# EAGLE design nedonand6 (EAGLE 5.12)
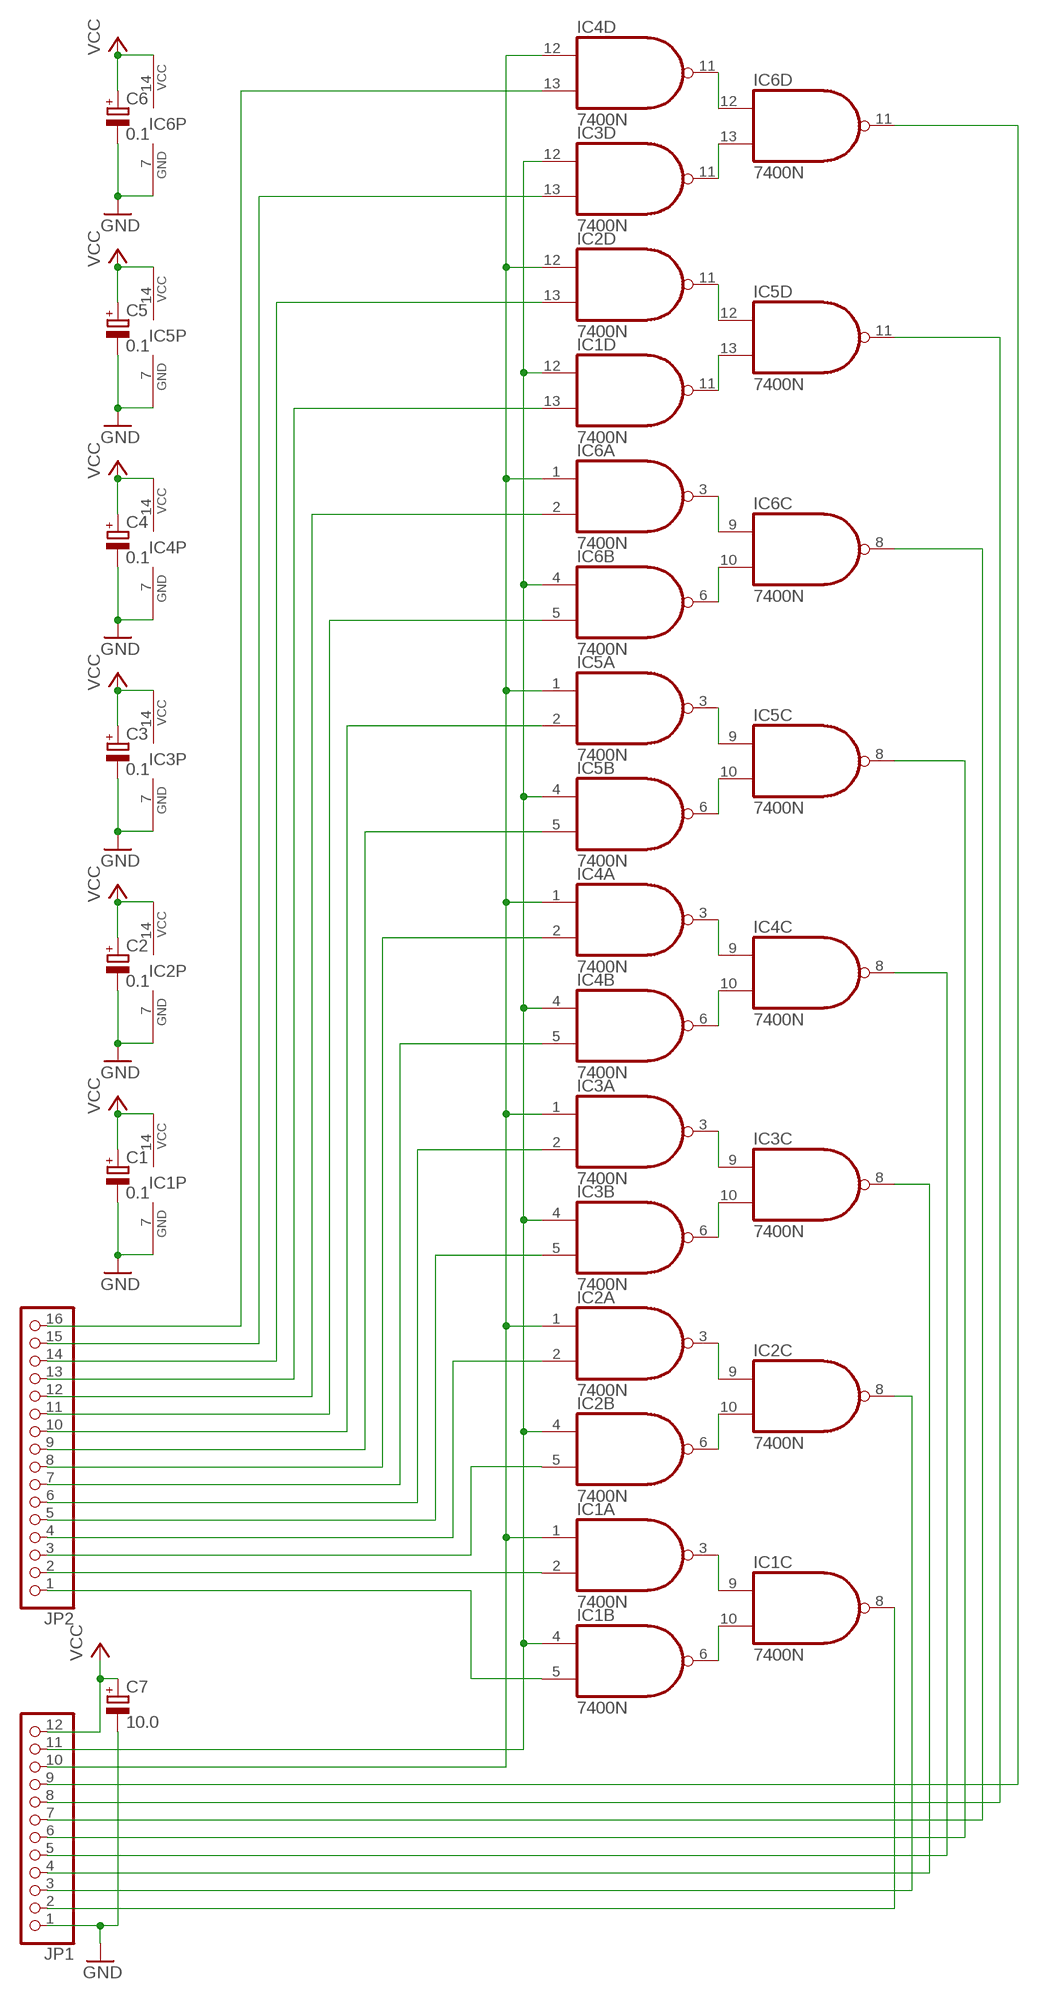
[diagram p0: schematic, sheet 1]

## Parts
C1  0.1  CPOL-EUB45181A  [B45181A]
C2  0.1  CPOL-EUB45181A  [B45181A]
C3  0.1  CPOL-EUB45181A  [B45181A]
C4  0.1  CPOL-EUB45181A  [B45181A]
C5  0.1  CPOL-EUB45181A  [B45181A]
C6  0.1  CPOL-EUB45181A  [B45181A]
C7  10.0  CPOL-EUE2,5-6E  [E2,5-6E]
IC1  7400N  [DIL14]
IC2  7400N  [DIL14]
IC3  7400N  [DIL14]
IC4  7400N  [DIL14]
IC5  7400N  [DIL14]
IC6  7400N  [DIL14]
JP1  PINHD-1X12/90  [1X12/90]
JP2  PINHD-1X16/90  [1X16/90]

## Nets
GND: C1.- C2.- C3.- C4.- C5.- C6.- C7.- IC1.7(P:GND) IC2.7(P:GND) IC3.7(P:GND) IC4.7(P:GND) IC5.7(P:GND) IC6.7(P:GND) JP1.1
N$1: IC4.11(D:O) IC6.12(D:I0)
N$2: IC1.3(A:O) IC1.9(C:I0)
N$3: IC1.6(B:O) IC1.10(C:I1)
N$4: IC1.4(B:I0) IC1.12(D:I0) IC2.4(B:I0) IC3.4(B:I0) IC3.12(D:I0) IC4.4(B:I0) IC5.4(B:I0) IC6.4(B:I0) JP1.11
N$5: IC1.1(A:I0) IC2.1(A:I0) IC2.12(D:I0) IC3.1(A:I0) IC4.1(A:I0) IC4.12(D:I0) IC5.1(A:I0) IC6.1(A:I0) JP1.10
N$6: IC2.3(A:O) IC2.9(C:I0)
N$7: IC1.2(A:I1) JP2.2
N$8: IC1.5(B:I1) JP2.1
N$9: IC2.6(B:O) IC2.10(C:I1)
N$10: IC2.5(B:I1) JP2.3
N$11: IC3.11(D:O) IC6.13(D:I1)
N$13: IC3.3(A:O) IC3.9(C:I0)
N$14: IC3.6(B:O) IC3.10(C:I1)
N$15: IC3.5(B:I1) JP2.5
N$16: IC2.11(D:O) IC5.12(D:I0)
N$18: IC4.3(A:O) IC4.9(C:I0)
N$19: IC4.6(B:O) IC4.10(C:I1)
N$20: IC4.5(B:I1) JP2.7
N$21: IC1.11(D:O) IC5.13(D:I1)
N$23: IC5.3(A:O) IC5.9(C:I0)
N$24: IC5.6(B:O) IC5.10(C:I1)
N$25: IC5.5(B:I1) JP2.9
N$28: IC6.3(A:O) IC6.9(C:I0)
N$29: IC6.6(B:O) IC6.10(C:I1)
N$30: IC6.5(B:I1) JP2.11
N$33: IC2.2(A:I1) JP2.4
N$35: IC3.2(A:I1) JP2.6
N$37: IC4.2(A:I1) JP2.8
N$39: IC5.2(A:I1) JP2.10
N$41: IC6.2(A:I1) JP2.12
N$42: IC1.13(D:I1) JP2.13
N$43: IC2.13(D:I1) JP2.14
N$44: IC3.13(D:I1) JP2.15
N$45: IC4.13(D:I1) JP2.16
N$46: IC1.8(C:O) JP1.2
N$47: IC2.8(C:O) JP1.3
N$48: IC3.8(C:O) JP1.4
N$49: IC4.8(C:O) JP1.5
N$50: IC5.8(C:O) JP1.6
N$51: IC6.8(C:O) JP1.7
N$52: IC5.11(D:O) JP1.8
N$53: IC6.11(D:O) JP1.9
VCC: C1.+ C2.+ C3.+ C4.+ C5.+ C6.+ C7.+ IC1.14(P:VCC) IC2.14(P:VCC) IC3.14(P:VCC) IC4.14(P:VCC) IC5.14(P:VCC) IC6.14(P:VCC) JP1.12

## Library data of the parts
C1-C7 = rcl:CPOL-EU: POLARIZED CAPACITOR, European symbol
IC1-IC6 = 74xx-us:74*00: Quad 2-input NAND gate
JP1 = pinhead:PINHD-1X12: PIN HEADER
JP2 = pinhead:PINHD-1X16: PIN HEADER

## Board
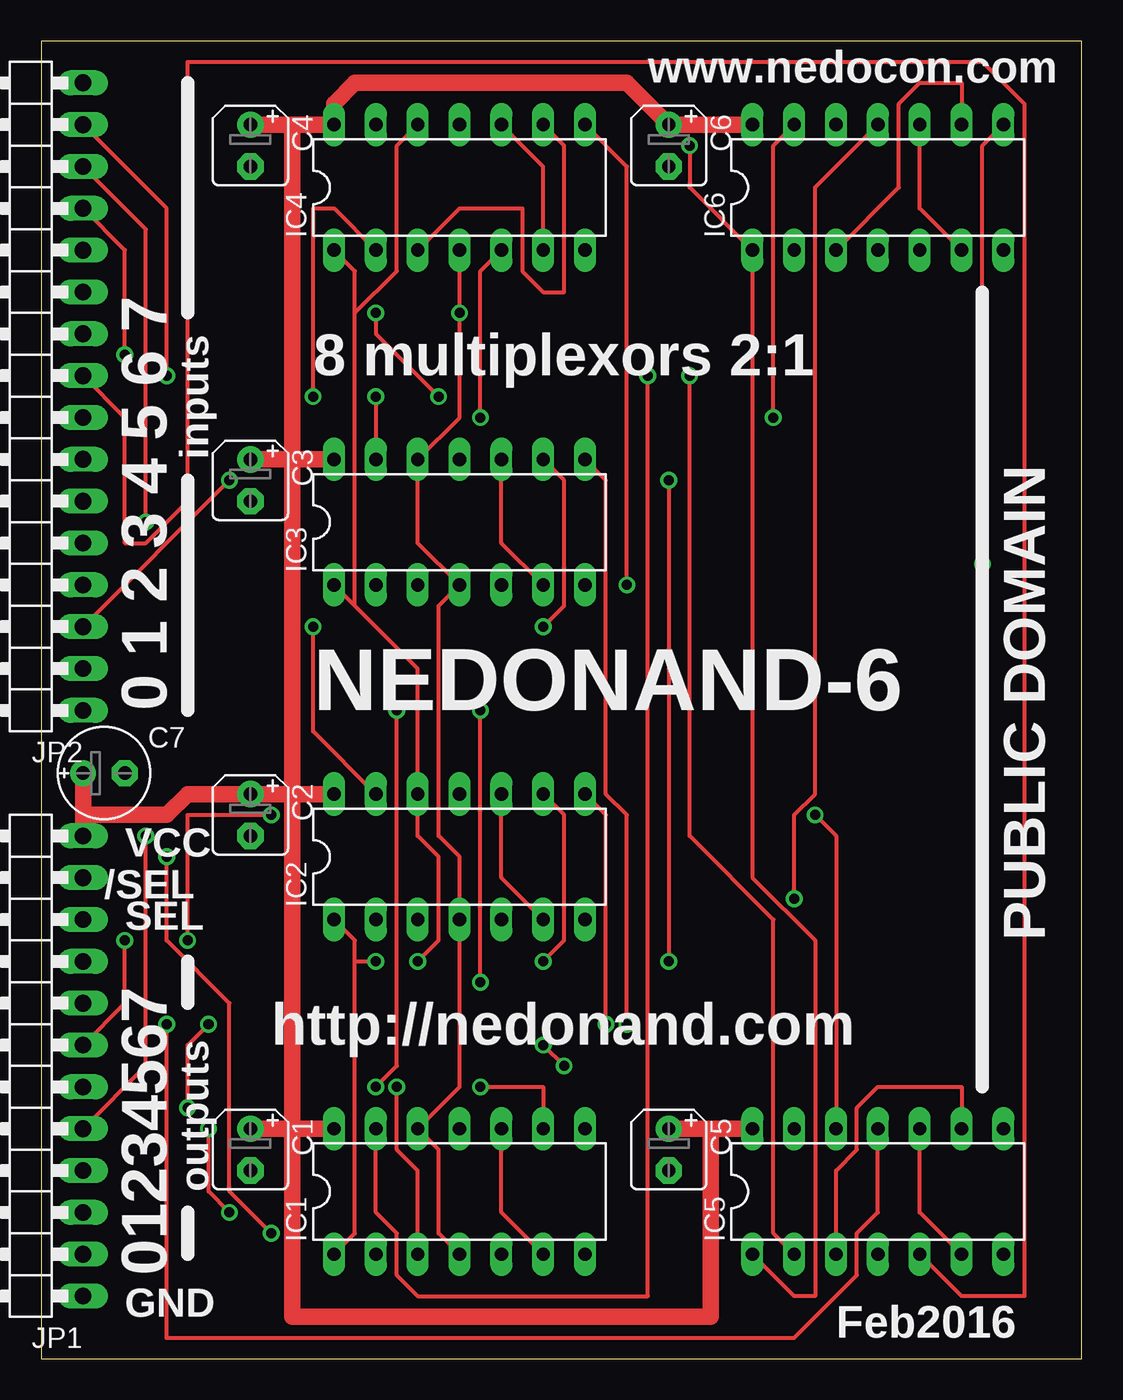
[diagram p1: board, top side]
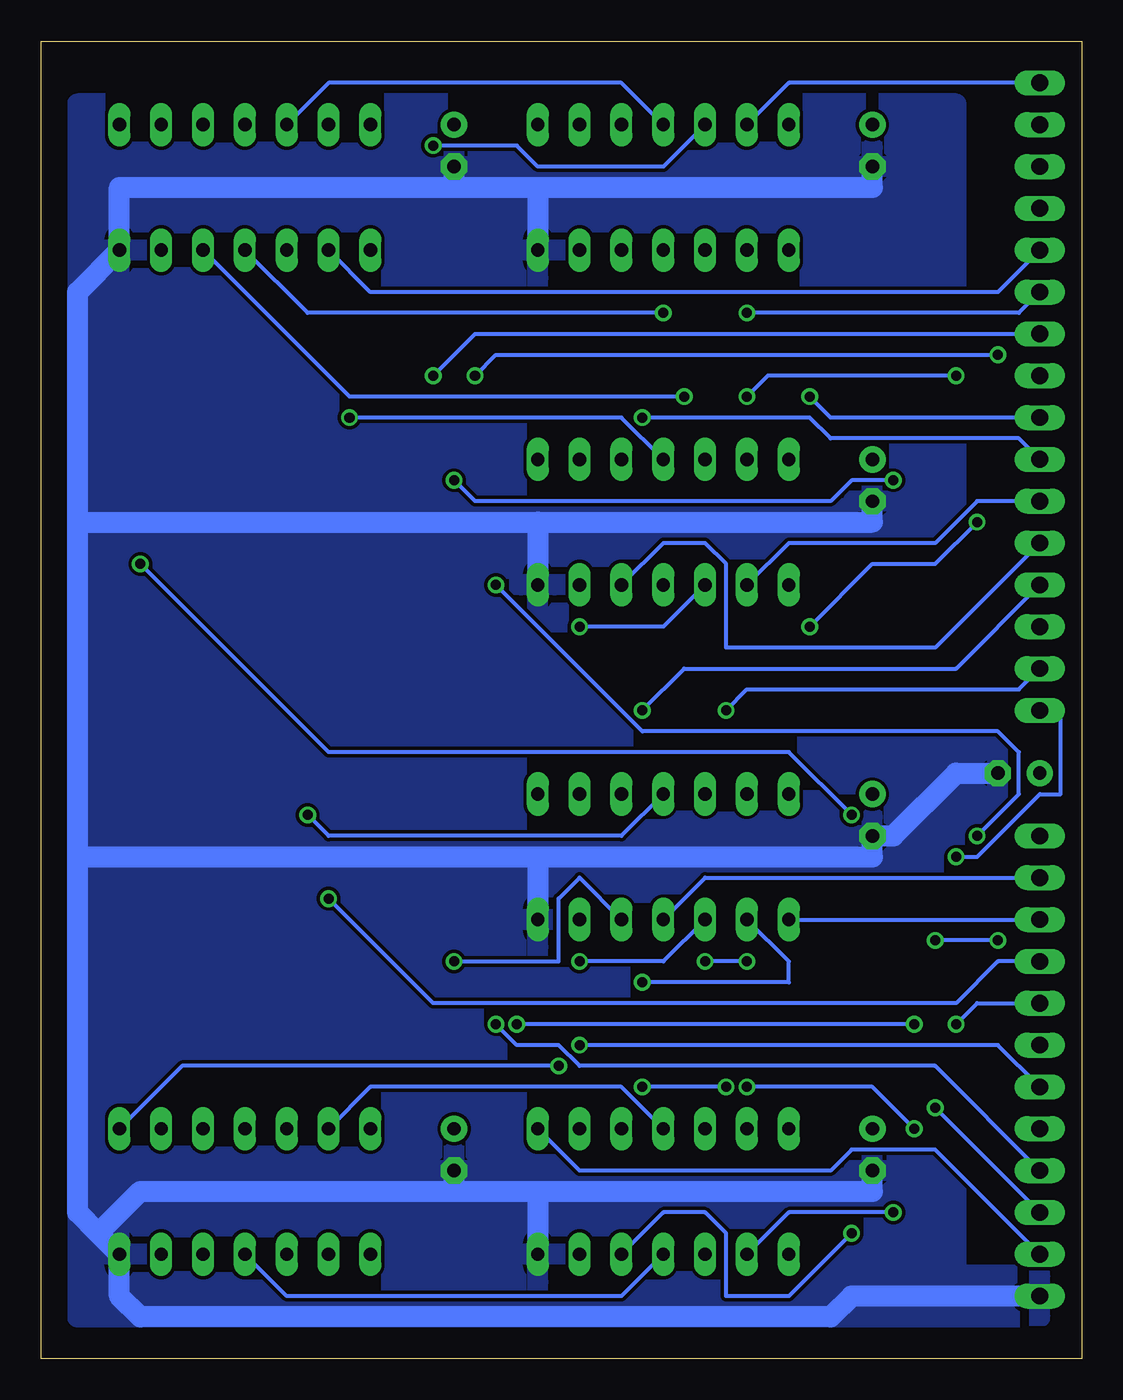
[diagram p2: board, bottom side, seen from below]

Size 63.17 x 80 mm. Coordinates in mm from the lower left corner, seen from the top.
Outline: 0,0 63.17,0 63.17,80 0,80 0,0
Copper layers (1*16): Top 0.035mm / dielectric 1.5mm / Bottom 0.035mm
Design rules "default": minimum track width 10mil, minimum drill 24mil, track to track 8mil, track to pad 8mil, pad to pad 8mil, via to via 8mil, smd to smd 8mil, copper to edge 40mil, drill to drill 8mil, minimum pad ring 10mil, minimum via ring 8mil, stop-mask expansion 4mil, vias tented up to drill 0mil, thermal gap 10mil

### Footprints (pad centres in the part's own frame; a part is rotated, then mirrored left to right if it is on the bottom)
B45181A = drill 0.813 pad 1.6 round: + -1.27,0 | drill 0.813 pad 1.6 octagon: - 1.27,0
E2,5-6E = drill 0.813 pad 1.575 round: + -1.27,0 | drill 0.813 pad 1.575 octagon: - 1.27,0
DIL14 = drill 0.813 long: 1 -7.62,-3.81; 2 -5.08,-3.81; 3 -2.54,-3.81; 4 0,-3.81; 5 2.54,-3.81; 6 5.08,-3.81; 7 7.62,-3.81; 8 7.62,3.81; 9 5.08,3.81; 10 2.54,3.81; 11 0,3.81; 12 -2.54,3.81; 13 -5.08,3.81; 14 -7.62,3.81
1X12/90 = drill 1.016 long: 1 -13.97,-3.81; 2 -11.43,-3.81; 3 -8.89,-3.81; 4 -6.35,-3.81; 5 -3.81,-3.81; 6 -1.27,-3.81; 7 1.27,-3.81; 8 3.81,-3.81; 9 6.35,-3.81; 10 8.89,-3.81; 11 11.43,-3.81; 12 13.97,-3.81
1X16/90 = drill 1.016 long: 1 -19.05,-3.81; 2 -16.51,-3.81; 3 -13.97,-3.81; 4 -11.43,-3.81; 5 -8.89,-3.81; 6 -6.35,-3.81; 7 -3.81,-3.81; 8 -1.27,-3.81; 9 1.27,-3.81; 10 3.81,-3.81; 11 6.35,-3.81; 12 8.89,-3.81; 13 11.43,-3.81; 14 13.97,-3.81; 15 16.51,-3.81; 16 19.05,-3.81

### Placement (x,y rotation side)
C1  12.7,12.7 270 top
C2  12.7,33.02 270 top
C3  12.7,53.34 270 top
C4  12.7,73.66 270 top
C5  38.1,12.7 270 top
C6  38.1,73.66 270 top
C7  3.81,35.56 0 top
IC1  25.4,10.16 0 top
IC2  25.4,30.48 0 top
IC3  25.4,50.8 0 top
IC4  25.4,71.12 0 top
IC5  50.8,10.16 0 top
IC6  50.8,71.12 0 top
JP1  -1.27,17.78 90 top
JP2  -1.27,58.42 90 top

### Tracks (layer width: path | path; a pad name or v marks a point on that pad's centre or on a via)
GND
  Bottom 1.27: JP1.1 13.97,3.81 15.24,2.54 57.15,2.54 58.42,3.81 IC5.7 59.69,7.62 | 60.96,30.48 60.96,8.89 59.69,7.62 | 60.96,30.48 60.96,50.8 | 60.96,50.8 60.96,64.77 IC6.7 58.42,71.12 38.1,71.12 | C3.- 12.7,50.8 33.02,50.8 | 60.96,50.8 33.02,50.8 | 60.96,30.48 33.02,30.48 | 33.02,30.48 12.7,30.48 C2.- 11.43,31.75 7.62,35.56 C7.- | C4.- 12.7,71.12 33.02,71.12 | 38.1,71.12 33.02,71.12 | 38.1,71.12 C6.- | 33.02,71.12 IC4.7 | 33.02,50.8 IC3.7 | 33.02,30.48 IC2.7 | C1.- 12.7,10.16 33.02,10.16 | 38.1,10.16 57.15,10.16 59.69,7.62 | 38.1,10.16 33.02,10.16 | 38.1,10.16 C5.- | 33.02,10.16 IC1.7
  pour Bottom: 7.62,76.2 60.96,76.2 60.96,2.54 2.54,2.54 2.54,5.08 7.62,5.08 7.62,31.75 5.08,31.75 5.08,39.37 7.62,39.37
N$1
  Bottom 0.254: IC4.11 27.94,77.47 45.72,77.47 IC6.12
N$2  (via drill 0.61)
  Top 0.254: IC1.3 22.86,11.43 21.59,12.7 v21.59,16.51 | v26.67,16.51 30.48,16.51 IC1.9
  Bottom 0.254: v21.59,16.51 v26.67,16.51
N$3
  Top 0.254: IC1.6 27.94,8.89 IC1.10
N$4  (via drill 0.61)
  Top 0.254: IC4.4 v25.4,63.5 25.4,57.15 IC3.12 22.86,49.53 IC3.4 24.13,45.72 24.13,31.75 25.4,30.48 IC2.4 25.4,16.51 IC1.12 24.13,12.7 24.13,7.62 IC1.4
  Bottom 0.254: IC6.4 46.99,63.5 v25.4,63.5 | IC2.4 22.86,29.21 JP1.11 | IC5.4 48.26,3.81 27.94,3.81 IC1.4
N$5  (via drill 0.61)
  Top 0.254: IC5.1 45.72,3.81 46.99,3.81 46.99,25.4 43.18,29.21 IC6.1 39.37,71.12 v39.37,73.66 | IC1.1 19.05,7.62 19.05,24.13 | 19.05,24.13 19.05,25.4 IC2.1 | 19.05,45.72 22.86,41.91 IC2.12 22.86,31.75 24.13,30.48 24.13,25.4 v22.86,24.13 | 19.05,45.72 IC3.1 | IC4.1 19.05,66.04 19.05,63.5 | 19.05,45.72 19.05,63.5 | IC4.12 21.59,73.66 21.59,66.04 19.05,63.5 | 19.05,24.13 v20.32,24.13
  Bottom 0.254: IC2.1 JP1.10 | v20.32,24.13 v22.86,24.13 | v39.37,73.66 34.29,73.66 33.02,72.39 25.4,72.39 IC4.12
N$6  (via drill 0.61)
  Top 0.254: v30.48,24.13 31.75,25.4 31.75,33.02 IC2.9
  Bottom 0.254: IC2.3 25.4,24.13 v30.48,24.13
N$7  (via drill 0.61)
  Top 0.254: v11.43,8.89 10.16,10.16 v10.16,13.97 | v20.32,16.51 21.59,17.78 v21.59,39.37
  Bottom 0.254: IC1.2 17.78,8.89 v11.43,8.89 | v10.16,13.97 12.7,16.51 v20.32,16.51 | v21.59,39.37 20.32,40.64 3.81,40.64 JP2.2
N$8  (via drill 0.61)
  Top 0.254: v13.97,7.62 11.43,10.16 11.43,21.59 7.62,25.4 v7.62,30.48
  Bottom 0.254: IC1.5 25.4,8.89 22.86,8.89 21.59,7.62 21.59,3.81 17.78,3.81 v13.97,7.62 | v7.62,30.48 6.35,30.48 2.54,34.29 1.27,34.29 1.27,39.37 JP2.1
N$9
  Top 0.254: IC2.6 27.94,29.21 IC2.10
N$10  (via drill 0.61)
  Top 0.254: v38.1,53.34 v38.1,24.13 | JP2.3 v11.43,53.34
  Bottom 0.254: IC2.5 30.48,29.21 31.75,27.94 31.75,24.13 v38.1,24.13 | v38.1,53.34 36.83,52.07 15.24,52.07 13.97,53.34 v11.43,53.34
N$11  (via drill 0.61)
  Top 0.254: v44.45,57.15 44.45,73.66 IC6.13
  Bottom 0.254: IC3.11 27.94,57.15 v44.45,57.15
N$13  (via drill 0.61)
  Top 0.254: v30.48,44.45 31.75,45.72 31.75,53.34 IC3.9
  Bottom 0.254: IC3.3 25.4,44.45 v30.48,44.45
N$14
  Top 0.254: IC3.6 27.94,49.53 IC3.10
N$15
  Bottom 0.254: IC3.5 25.4,49.53 22.86,49.53 21.59,48.26 21.59,43.18 8.89,43.18 JP2.5
N$16  (via drill 0.61)
  Top 0.254: v46.99,33.02 48.26,31.75 IC5.12
  Bottom 0.254: IC2.11 27.94,31.75 45.72,31.75 v46.99,33.02
N$18
  Top 0.254: IC4.3 25.4,69.85 29.21,69.85 29.21,66.04 30.48,64.77 31.75,64.77 31.75,73.66 IC4.9
N$19
  Top 0.254: IC4.6 30.48,72.39 IC4.10
N$20  (via drill 0.61)
  Top 0.254: IC4.5 26.67,66.04 v26.67,57.15
  Bottom 0.254: v26.67,57.15 16.51,57.15 15.24,55.88 3.81,55.88 JP2.7
N$21
  Bottom 0.254: IC1.11 27.94,16.51 43.18,16.51 IC5.13
N$23
  Top 0.254: IC5.3 48.26,11.43 49.53,12.7 49.53,15.24 50.8,16.51 55.88,16.51 IC5.9
N$24
  Top 0.254: IC5.6 53.34,8.89 IC5.10
N$25
  Top 0.254: IC5.5 55.88,3.81 59.69,3.81 59.69,76.2 57.15,78.74 8.89,78.74 8.89,52.07 6.35,49.53 5.08,49.53 5.08,57.15 JP2.9
N$28
  Top 0.254: IC6.3 52.07,71.12 52.07,76.2 53.34,77.47 55.88,77.47 IC6.9
N$29
  Top 0.254: IC6.6 53.34,69.85 IC6.10
N$30  (via drill 0.61)
  Top 0.254: v24.13,58.42 20.32,62.23 v20.32,63.5
  Bottom 0.254: IC6.5 44.45,58.42 v24.13,58.42 | v20.32,63.5 3.81,63.5 JP2.11
N$33  (via drill 0.61)
  Top 0.254: v26.67,22.86 v26.67,39.37
  Bottom 0.254: IC2.2 17.78,24.13 17.78,22.86 v26.67,22.86 | v26.67,39.37 24.13,41.91 7.62,41.91 JP2.4
N$35
  Bottom 0.254: IC3.2 17.78,49.53 8.89,49.53 6.35,52.07 JP2.6
N$37  (via drill 0.61)
  Top 0.254: IC4.2 17.78,69.85 16.51,69.85 v16.51,58.42
  Bottom 0.254: v16.51,58.42 15.24,57.15 JP2.8
N$39  (via drill 0.61)
  Top 0.254: IC5.2 44.45,7.62 44.45,26.67 39.37,31.75 v39.37,59.69
  Bottom 0.254: v39.37,59.69 36.83,62.23 JP2.10
N$41
  Bottom 0.254: IC6.2 43.18,64.77 5.08,64.77 JP2.12
N$42  (via drill 0.61)
  Top 0.254: IC1.13 20.32,8.89 21.59,7.62 21.59,5.08 22.86,3.81 36.83,3.81 v36.83,59.69 | v5.08,60.96 5.08,67.31 JP2.13
  Bottom 0.254: v36.83,59.69 35.56,60.96 v5.08,60.96
N$43  (via drill 0.61)
  Top 0.254: IC2.13 16.51,38.1 v16.51,44.45 | v6.35,50.8 6.35,68.58 JP2.14
  Bottom 0.254: v16.51,44.45 12.7,48.26 8.89,48.26 v6.35,50.8
N$44  (via drill 0.61)
  Top 0.254: v20.32,58.42 IC3.13 | v7.62,59.69 7.62,69.85 JP2.15
  Bottom 0.254: v20.32,58.42 19.05,59.69 v7.62,59.69
N$45
  Bottom 0.254: IC4.13 17.78,77.47 JP2.16
N$46
  Bottom 0.254: IC1.8 30.48,11.43 15.24,11.43 13.97,12.7 8.89,12.7 JP1.2
N$47  (via drill 0.61)
  Top 0.254: IC2.8 34.29,33.02 v34.29,20.32 | v10.16,20.32 8.89,19.05 v8.89,15.24
  Bottom 0.254: v10.16,20.32 v34.29,20.32 | JP1.3 v8.89,15.24
N$48  (via drill 0.61)
  Top 0.254: IC3.8 34.29,53.34 34.29,34.29 35.56,33.02 v35.56,20.32
  Bottom 0.254: v35.56,20.32 34.29,19.05 31.75,19.05 30.48,17.78 8.89,17.78 JP1.4
N$49  (via drill 0.61)
  Top 0.254: IC4.8 35.56,72.39 v35.56,46.99 | v6.35,31.75 6.35,17.78 JP1.5
  Bottom 0.254: v35.56,46.99 26.67,38.1 5.08,38.1 3.81,36.83 3.81,34.29 v6.35,31.75
N$50  (via drill 0.61)
  Top 0.254: v30.48,19.05 v31.75,17.78
  Bottom 0.254: IC5.8 54.61,17.78 v31.75,17.78 | v30.48,19.05 5.08,19.05 JP1.6
N$51  (via drill 0.61)
  Top 0.254: IC6.8 57.15,73.66 v57.15,48.26 | v13.97,33.02 8.89,33.02 v8.89,25.4 | v5.08,25.4 5.08,21.59 JP1.7
  Bottom 0.254: v57.15,48.26 45.72,36.83 17.78,36.83 v13.97,33.02 | v5.08,25.4 v8.89,25.4
N$52  (via drill 0.61)
  Top 0.254: IC5.11 50.8,8.89 49.53,7.62 49.53,5.08 45.72,1.27 7.62,1.27 v7.62,20.32
  Bottom 0.254: v7.62,20.32 6.35,21.59 JP1.8
N$53  (via drill 0.61)
  Top 0.254: IC6.11 46.99,71.12 46.99,34.29 45.72,33.02 v45.72,27.94
  Bottom 0.254: v45.72,27.94 39.37,21.59 7.62,21.59 5.08,24.13 JP1.9
VCC
  Top 1.016: 2.54,33.02 JP1.12 | 2.54,33.02 C7.+ | 2.54,33.02 7.62,33.02 8.89,34.29 C2.+ 15.24,34.29 | 15.24,34.29 IC2.14 | IC6.14 C6.+ 35.56,77.47 19.05,77.47 17.78,76.2 IC4.14 15.24,74.93 | 15.24,74.93 C4.+ | 40.64,13.97 IC5.14 | 40.64,13.97 C5.+ | 40.64,13.97 40.64,2.54 15.24,2.54 15.24,13.97 | 15.24,34.29 15.24,54.61 | 15.24,54.61 15.24,74.93 | 15.24,13.97 IC1.14 | 15.24,54.61 C3.+ | 15.24,54.61 IC3.14 | 15.24,13.97 C1.+ | 15.24,13.97 15.24,34.29

### Text on the board
tNames: www.nedocon.com | 8 multiplexors 2:1 | inputs | 0 1 2 3 4 5 6 7 | NEDONAND-6 | VCC | /SEL | SEL | PUBLIC DOMAIN | http://nedonand.com | outputs | 01234567 | GND | Feb2016